# EAGLE design schematic (EAGLE 9.6.2)
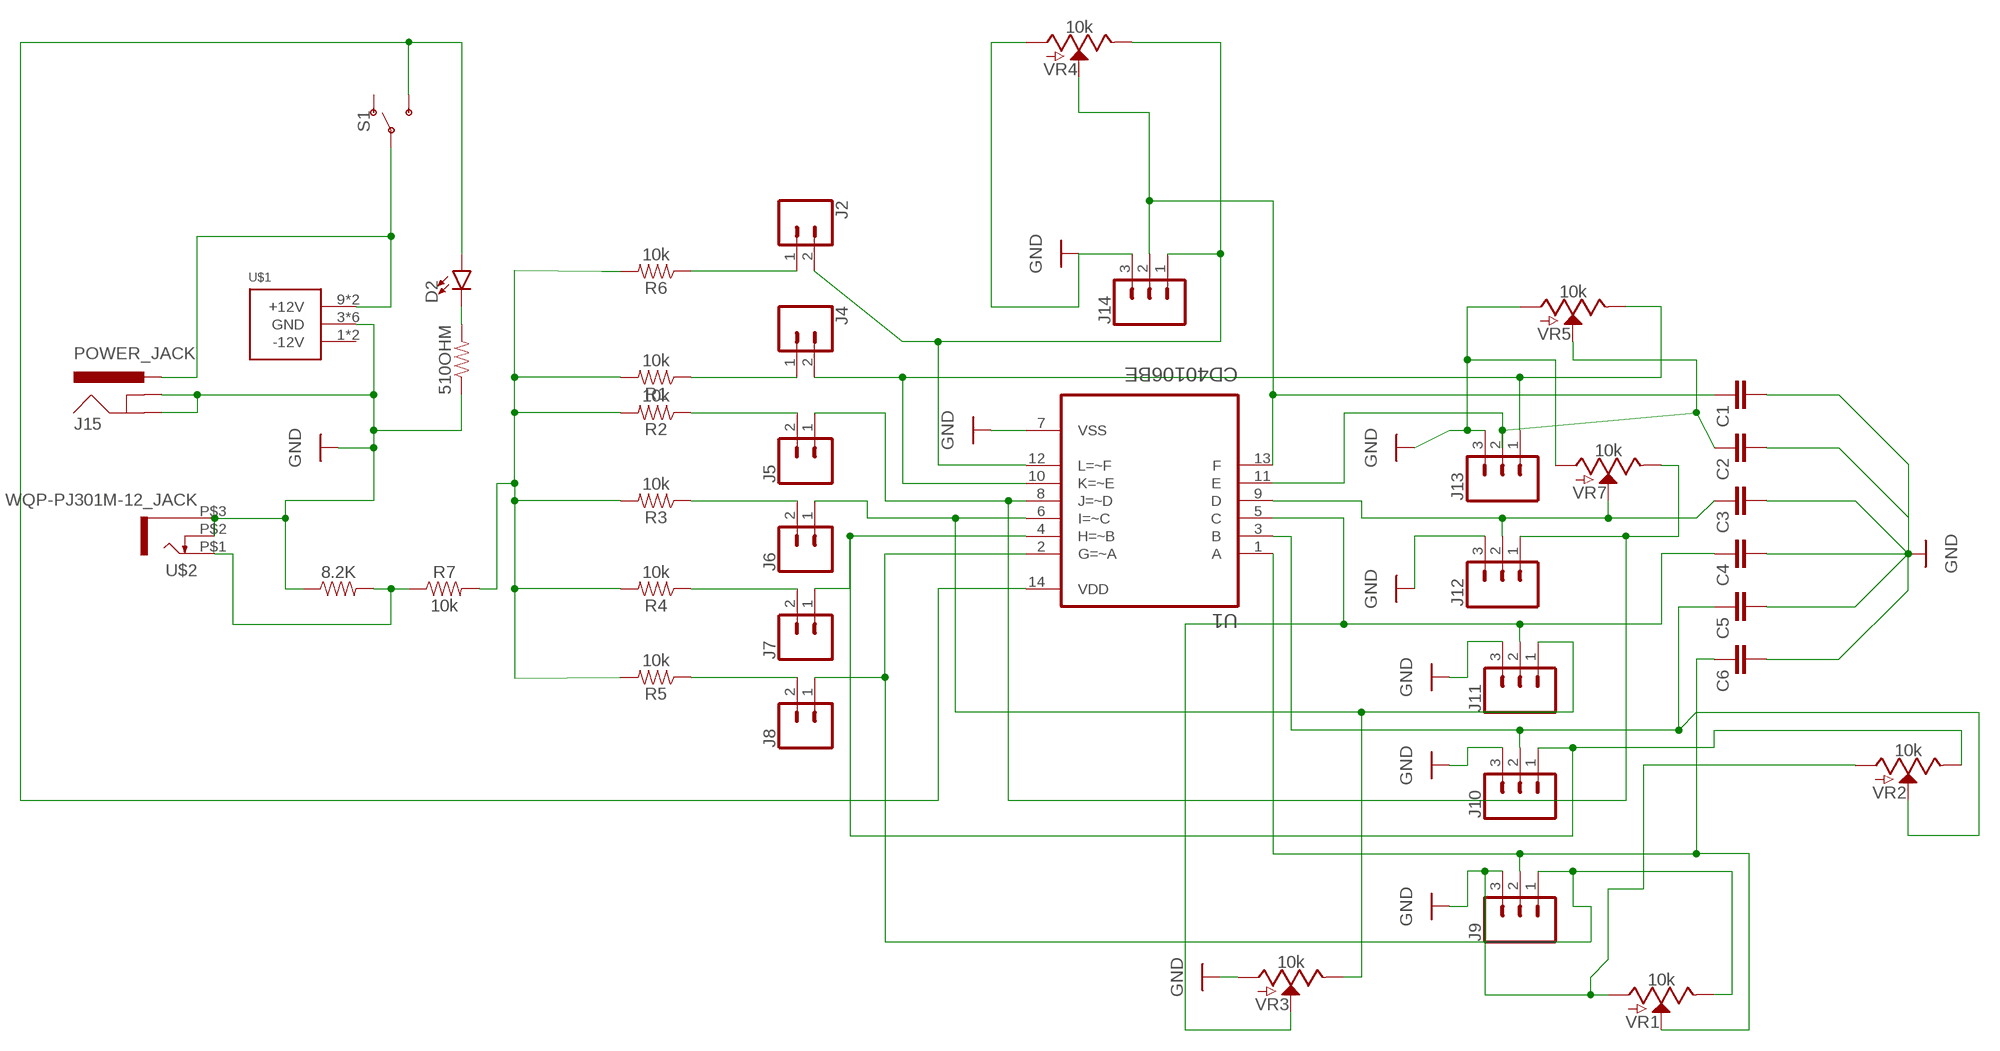
[diagram p0: schematic, sheet 1]

## Parts
8.2K  RESISTORAXIAL-0.3  [AXIAL-0.3]
510OHM  RESISTORAXIAL-0.3  [AXIAL-0.3]
C1  C5/5  [C5B5]
C2  C5/5  [C5B5]
C3  C5/5  [C5B5]
C4  C5/5  [C5B5]
C5  C5/5  [C5B5]
C6  C5/5  [C5B5]
D2  LED5MM  [LED_5MM]
J2  CONN_02  [1X02]
J4  CONN_02  [1X02]
J5  CONN_02  [1X02]
J6  CONN_02  [1X02]
J7  CONN_02  [1X02]
J8  CONN_02  [1X02]
J9  CONN_03  [1X03]
J10  CONN_03  [1X03]
J11  CONN_03  [1X03]
J12  CONN_03  [1X03]
J13  CONN_03  [1X03]
J14  CONN_03  [1X03]
J15  POWER_JACK  [POWER_JACK_PTH]
R1  10k  10KOHM-HORIZ-1/4W-1%  [AXIAL-0.3]
R2  10k  10KOHM-HORIZ-1/4W-1%  [AXIAL-0.3]
R3  10k  10KOHM-HORIZ-1/4W-1%  [AXIAL-0.3]
R4  10k  10KOHM-HORIZ-1/4W-1%  [AXIAL-0.3]
R5  10k  10KOHM-HORIZ-1/4W-1%  [AXIAL-0.3]
R6  10k  10KOHM-HORIZ-1/4W-1%  [AXIAL-0.3]
R7  10k  10KOHM-HORIZ-1/4W-1%  [AXIAL-0.3]
S1  SWITCH-SPDT-PTH-11.6X4.0MM  [SWITCH_SPDT_PTH_11.6X4.0MM]
U1  CD40106BE  [DIP794W45P254L1969H508Q14]
U$1  POWER_SIMPLE16  [POWER_16]
U$2  WQP-PJ301M-12_JACK  [WQP-PJ301M-12_JACK]
VR1  10k  POTENTIOMETER-PTH-9MM-1/20W-20%  [POT-PTH-ALPS]
VR2  10k  POTENTIOMETER-PTH-9MM-1/20W-20%  [POT-PTH-ALPS]
VR3  10k  POTENTIOMETER-PTH-9MM-1/20W-20%  [POT-PTH-ALPS]
VR4  10k  POTENTIOMETER-PTH-9MM-1/20W-20%  [POT-PTH-ALPS]
VR5  10k  POTENTIOMETER-PTH-9MM-1/20W-20%  [POT-PTH-ALPS]
VR7  10k  POTENTIOMETER-PTH-9MM-1/20W-20%  [POT-PTH-ALPS]

## Nets
GND: 8.2K.P$1 510OHM.P$1 C1.2 C2.2 C3.2 C4.2 C5.2 C6.2 J9.3 J10.3 J11.3 J12.3 J13.3 J14.3 J15.GND J15.GNDBREAK U1.7(VSS) U$1.3(GND) U$1.4(GND) U$1.5(GND) U$1.6(GND) U$1.7(GND) U$1.8(GND) U$2.P$2 U$2.P$3 VR1.P$3(A) VR2.P$3(A) VR3.P$3(A) VR4.P$3(A) VR5.P$3(A) VR7.P$3(A)
N$1: 510OHM.P$2 D2.K(C)
N$2: C1.1 J14.2 U1.13(F) VR4.P$2(S)
N$3: J2.2 J14.1 U1.12(L=~F) VR4.P$1(E)
N$4: J4.1 R1.P$1
N$5: J5.1 J12.1 U1.8(J=~D) VR7.P$1(E)
N$6: C4.1 J11.2 U1.5(C) VR3.P$2(S)
N$7: C5.1 J10.2 U1.3(B) VR2.P$2(S)
N$8: C6.1 J9.2 U1.1(A) VR1.P$2(S)
N$9: C2.1 J13.2 U1.11(E) VR5.P$2(S)
N$10: J5.2 R2.P$1
N$11: J8.2 R5.P$1
N$12: J7.2 R4.P$1
N$13: J6.2 R3.P$1
N$14: J2.1 R6.P$1
N$15: J4.2 J13.1 U1.10(K=~E) VR5.P$1(E)
N$16: C3.1 J12.2 U1.9(D) VR7.P$2(S)
N$17: J6.1 J11.1 U1.6(I=~C) VR3.P$1(E)
N$18: J7.1 J10.1 U1.4(H=~B) VR2.P$1(E)
N$19: J8.1 J9.1 U1.2(G=~A) VR1.P$1(E)
N$21: 8.2K.P$2 R7.P$1 U$2.P$1
N$23: R1.P$2 R2.P$2 R3.P$2 R4.P$2 R5.P$2 R6.P$2 R7.P$2
N$24: J15.PWR S1.2(P) U$1.9(+12V) U$1.10(+12V)
N$25: D2.A S1.3(S) U1.14(VDD)
Unconnected: S1.1(O) U$1.1(-12V) U$1.2(-12V)

## Library data of the parts
8.2K 510OHM = SparkFun-Resistors:RESISTOR: Generic Resistor Package
C1-C6 = capacitor-wima:C: CAPACITOR naming: grid - package width
D2 = SparkFun-LED:LED: LED (Generic) Standard schematic elements and footprints for 5mm, 3mm, 1206, and 0603 sized LEDs. Generic LEDs with no color specified.
J2 J4-J8 = SparkFun-Connectors:CONN_02: Multi connection point. Often used as Generic Header-pin footprint for 0.1 inch spaced/style header connections On any of the 0.1 inch spaced packages, you can populate with these: Break Away Headers - Straight <https://www.sparkfun.com/products/116> (PRT-00116) Break Away Male Headers - Right Angle <https://www.sparkfun.com/products/553> (PRT-00553) Female Headers <https://www.sparkfun.com/products/115> (PRT-00115) Break Away Headers - Machine Pin <https://www.sparkfun.com/products/117> (PRT-00117) Break Away Female Headers - Swiss Machine Pin <https://www.sparkfun.com/products/743> (PRT-00743) For SCREWTERMINALS and SPRING TERMINALS visit here: Screw Terimnals on SparkFun.com <https://www.sparkfun.com/search/results?term=Screw+Terminals> (5mm/3.5mm/2.54mm spacing) This device is also useful as a general connection point to wire up your design to another part of your project. Our various solder wires solder well into these plated through hole pads. Hook-Up Wire - Assortment (Stranded, 22 AWG) <https://www.sparkfun.com/products/11375> (PRT-11375) Hook-Up Wire - Assortment (Solid Core, 22 AWG) <https://www.sparkfun.com/products/11367> (PRT-11367) View the entire wire category on our website here <https://www.sparkfun.com/categories/141> Special notes: Molex polarized connector foot print use with: PRT-08233 with associated crimp pins and housings. 2.54_SCREWTERM for use with PRT-10571. 3.5mm Screw Terminal footprints for PRT-08084 5mm Screw Terminal footprints for use with PRT-08432
J9-J14 = SparkFun-Connectors:CONN_03: Multi connection point. Often used as Generic Header-pin footprint for 0.1 inch spaced/style header connections On any of the 0.1 inch spaced packages, you can populate with these: Break Away Headers - Straight <https://www.sparkfun.com/products/116> (PRT-00116) Break Away Male Headers - Right Angle <https://www.sparkfun.com/products/553> (PRT-00553) Female Headers <https://www.sparkfun.com/products/115> (PRT-00115) Break Away Headers - Machine Pin <https://www.sparkfun.com/products/117> (PRT-00117) Break Away Female Headers - Swiss Machine Pin <https://www.sparkfun.com/products/743> (PRT-00743) Stackable Header - 3 Pin (Female, 0.1") <https://www.sparkfun.com/products/13875> (PRT-13875) For SCREWTERMINALS and SPRING TERMINALS visit here: Screw Terimnals on SparkFun.com <https://www.sparkfun.com/search/results?term=Screw+Terminals> (5mm/3.5mm/2.54mm spacing) This device is also useful as a general connection point to wire up your design to another part of your project. Our various solder wires solder well into these plated through hole pads. Hook-Up Wire - Assortment (Stranded, 22 AWG) <https://www.sparkfun.com/products/11375> (PRT-11375) Hook-Up Wire - Assortment (Solid Core, 22 AWG) <https://www.sparkfun.com/products/11367> (PRT-11367) View the entire wire category on our website here <https://www.sparkfun.com/categories/141> Special notes: Molex polarized connector foot print use with SKU : PRT-08232 with associated crimp pins and housings.
J15 = SparkFun-Connectors:POWER_JACK: Power Jack Connector This is the standard 5.5mm barrel jack for power. The PTH is the most common, proven, reliable, footprint. The Slot footprint only works if the mill layer is transmitted to the PCB fab house so be warned. Here are the connectors we sell at SparkFun: DC Barrel Power Jack/Connector <https://www.sparkfun.com/products/119> (PRT-00119) DC Barrel Power Jack/Connector (SMD) <https://www.sparkfun.com/products/12748> (PRT-12748) DC Barrel Jack Adapter - Breadboard Compatible <https://www.sparkfun.com/products/10811> (PRT-10811) It is used on this SparkFun product (and many, many others): SparkFun RedBoard - Programmed with Arduino <https://www.sparkfun.com/products/12757> (DEV-12757) Also, if you need a mating power supply or connector, please check these out: Wall Adapter Power Supply - 9VDC 650mA <https://www.sparkfun.com/products/298> (TOL-00298) DC Barrel Jack Adapter - Male <https://www.sparkfun.com/products/10287> (PRT-10287); PROD_ID: CONN-08197
R1-R7 = SparkFun-Resistors:10KOHM: 10kΩ resistor A resistor is a passive two-terminal electrical component that implements electrical resistance as a circuit element. Resistors act to reduce current flow, and, at the same time, act to lower voltage levels within circuits. - Wikipedia; PROD_ID: RES-12183
S1 = SparkFun-Switches:SWITCH-SPDT: Single Pole, Double Throw (SPDT) Switch Single-pole, double-throw (SPDT) switch. Variant Overview SMD-AYZ0202 Surface Mount DPDT Switch <https://www.sparkfun.com/products/597> (COM-00597) Used on e.g. LilyPad Arduino USB - ATmega32U4 Board <https://www.sparkfun.com/products/12049> PTH-11.6X4.0MM SPDT Mini Power Switch <https://www.sparkfun.com/products/102> (COM-00102) Used on e.g. SparkFun Simon Says - Through-Hole Soldering Kit <https://www.sparkfun.com/products/10547> (KIT-10547) PTH-11.6X4.0MM-KIT KIT version of SPDT Mini Power Switch - Simplifies soldering by removing tStop of switch pins - only one side can be soldered. PTH-11.6X4.0MM-LOCK LOCK version of SPDT Mini Power Switch - Offset pins hold switch in place for easier soldering. SMD-RIGHT-ANGLE Surface Mount Right Angle Switch <https://www.sparkfun.com/products/10860> (COM-10860) Used on e.g. SparkFun ESP8266 Thing <https://www.sparkfun.com/products/13231>; PROD_ID: SWCH-08261; SF_SKU: COM-00102
U1 = CD40106BE:CD40106BE: Check availability <https://pricing.snapeda.com/parts/CD40106BE/Texas%20Instruments/view-part?ref=eda>; AVAILABILITY: In Stock; DESCRIPTION: 6-ch, 3-V to 18-V inverters with Schmitt-Trigger inputs; MF: Texas Instruments; MP: CD40106BE; PACKAGE: PDIP-14 Texas Instruments; PRICE: None; PURCHASE-URL: https://pricing.snapeda.com/search/part/CD40106BE/?ref=eda
U$1 = eurorack:POWER_SIMPLE
U$2 = thonkiconn:WQP-PJ301M-12_JACK
VR1-VR5 VR7 = SparkFun-Resistors:POTENTIOMETER: Potentiometer (Pot) Three-terminal potentiometers, with an adjustable wiper and two adjustable resistors. A pot can be used to create a configurable voltage divider, or as a variable resistor. Variants ALPS_POT and ALPS_POT_KIT - PTH, breadboard compatible, 9mm square pots Rotary Potentiometer - Linear (10k ohm) <https://www.sparkfun.com/products/9288> (COM-09288) The KIT variant exposes copper on only one side of the PTH pad, so the part can only be assembled on one side of the PCB. Useful for beginner soldering kits.; PROD_ID: RES-09177; SF_SKU: COM-09288

## Board
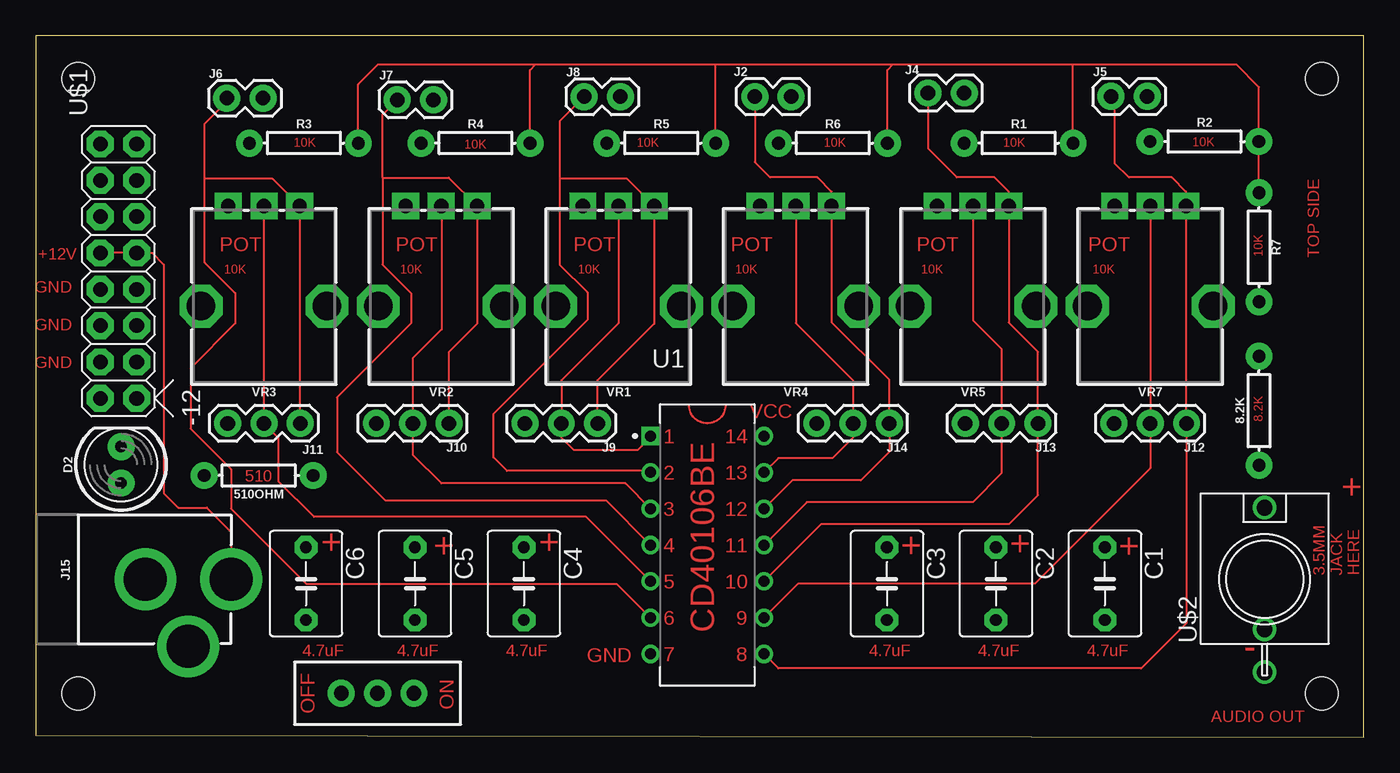
[diagram p1: board, top side]
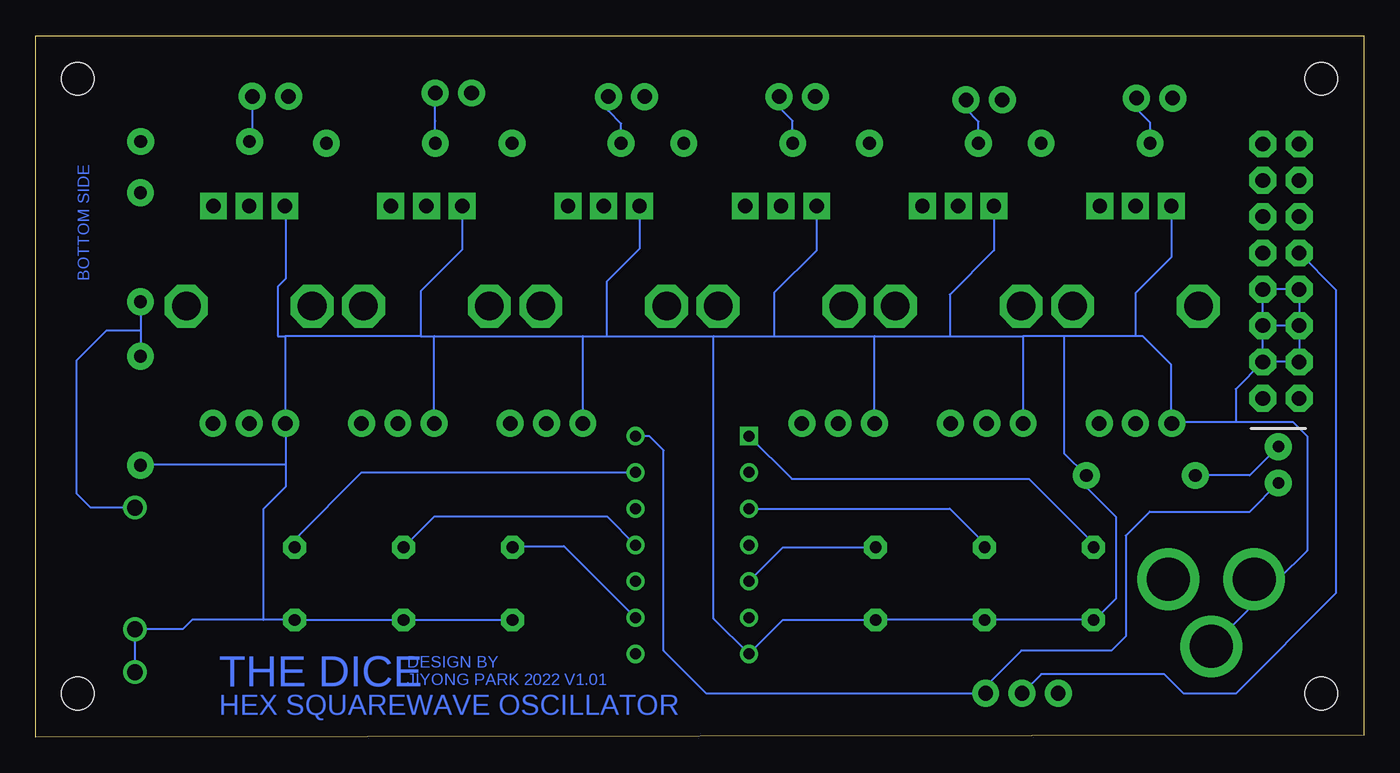
[diagram p2: board, bottom side, seen from below]

Size 92.9 x 49.04 mm. Coordinates in mm from the lower left corner, seen from the top.
Outline: 0,0.13 92.9,0 92.9,49.04 0,49.04 0,0.13
Copper layers (1*16): Top 0.035mm / dielectric 1.5mm / Bottom 0.035mm
Design rules "default": minimum track width 6mil, minimum drill 0.35mm, track to track 6mil, track to pad 6mil, pad to pad 6mil, via to via 6mil, smd to smd 6mil, copper to edge 40mil, drill to drill 6mil, minimum pad ring 10mil, minimum via ring 8mil, stop-mask expansion 4mil, vias tented up to drill 0mil, thermal gap 10mil
Holes 2.3 mm at 2.97,46.04 2.97,3.04 89.97,3.04 89.97,46.04

### Footprints (pad centres in the part's own frame; a part is rotated, then mirrored left to right if it is on the bottom)
AXIAL-0.3 = drill 0.9 pad 1.88: P$1 -3.81,0; P$2 3.81,0
C5B5 = drill 0.813 pad 1.6 octagon: 1 -2.54,0; 2 2.54,0
LED_5MM = drill 0.813 pad 1.88: A -1.27,0; K 1.27,0
1X02 = drill 1.016 pad 1.88: 1 0,0; 2 2.54,0
1X03 = drill 1.016 pad 1.88: 1 0,0; 2 2.54,0; 3 5.08,0
POWER_JACK_PTH = drill 2.997 pad 4.318: GND 0,7.7; GNDBREAK 4.7,10.7; PWR 0,13.7
SWITCH_SPDT_PTH_11.6X4.0MM = drill 1.016 pad 1.88: 1 0,2.54; 2 0,0; 3 0,-2.54
DIP794W45P254L1969H508Q14 = drill 0.77 pad 1.17 square: 1 -3.97,7.62 | drill 0.77 pad 1.17: 2 -3.97,5.08; 3 -3.97,2.54; 4 -3.97,0; 5 -3.97,-2.54; 6 -3.97,-5.08; 7 -3.97,-7.62; 8 3.97,-7.62; 9 3.97,-5.08; 10 3.97,-2.54; 11 3.97,0; 12 3.97,2.54; 13 3.97,5.08; 14 3.97,7.62
POWER_16 = drill 1.016 pad 1.88 octagon: 1 -6.35,-1.27; 2 -6.35,1.27; 3 -3.81,-1.27; 4 -3.81,1.27; 5 -1.27,-1.27; 6 -1.27,1.27; 7 1.27,-1.27; 8 1.27,1.27; 9 3.81,-1.27; 10 3.81,1.27; 11 6.35,-1.27; 12 6.35,1.27; 13 8.89,-1.27; 14 8.89,1.27; 15 11.43,-1.27; 16 11.43,1.27
WQP-PJ301M-12_JACK = drill 1.1: P$1 0,5; P$2 0,-3.5; P$3 0,-6.5
POT-PTH-ALPS = drill 1 pad 1.88 square: P$1 7,-2.5; P$2 7,0; P$3 7,2.5 | drill 2 octagon: P$4 0,-4.4; P$5 0,4.4

### Placement (x,y rotation side)
8.2K  85.57,22.83 90 top
510OHM  15.6,18.29 180 top
C1  74.79,10.73 270 top
C2  67.17,10.73 270 top
C3  59.55,10.73 270 top
C4  34.15,10.73 270 top
C5  26.53,10.73 270 top
C6  18.91,10.73 270 top
D2  5.97,19.04 90 top
J2  52.84,44.79 180 top
J4  64.95,45.04 180 top
J5  75.21,44.8 0 top
J6  13.37,44.67 0 top
J7  25.29,44.56 0 top
J8  38.36,44.78 0 top
J9  39.31,21.94 180 top
J10  28.91,21.94 180 top
J11  18.51,21.94 180 top
J12  80.51,21.94 180 top
J13  70.11,21.94 180 top
J14  59.71,21.94 180 top
J15  -0.03,11.04 270 top
R1  68.76,41.54 0 top
R2  81.76,41.65 0 top
R3  18.76,41.54 0 top
R4  30.76,41.54 0 top
R5  43.76,41.54 0 top
R6  55.76,41.54 0 top
R7  85.57,34.25 90 top
S1  23.91,3.06 90 top
U1  46.97,13.43 0 top
U$1  5.79,30.04 90 top
U$2  85.97,11.04 0 top
VR1  40.77,30.14 90 top
VR2  28.37,30.14 90 top
VR3  15.97,30.14 90 top
VR4  53.17,30.14 90 top
VR5  65.57,30.14 90 top
VR7  77.97,30.14 90 top

### Tracks (layer width: path | path; a pad name or v marks a point on that pad's centre or on a via)
GND
  Top 0.152: U1.7 42.97,5.77
  Bottom 0.152: C3.2 C2.2 C1.2 76.97,8.19 | J10.3 23.83,21.76 | J10.3 23.83,28.04 | J9.3 34.23,28.04 | J14.3 54.63,28.04 | J13.3 65.03,28.04 | U$1.6 U$1.5 | U$1.8 U$1.7 U$1.5 | U$1.6 U$1.4 U$1.3 | U$1.3 U$1.5 | U$1.8 4.51,31.3 | 65.97,28.04 65.03,28.04 | 65.03,28.04 54.63,28.04 | 54.63,28.04 52.97,28.04 | 52.97,28.04 45.48,28.04 | 45.48,28.04 41.23,28.04 | 41.23,28.04 34.23,28.04 | 34.23,28.04 28.97,28.04 | 28.97,28.04 23.83,28.04 | 76.97,8.19 76.95,8.21 76.95,15.97 75.43,17.5 75.43,19.04 | VR1.P$3 38.27,34.06 41.23,31.1 41.23,28.04 | J10.3 23.87,21.98 | VR2.P$3 25.87,34.04 28.97,30.94 28.97,28.04 | VR4.P$3 50.67,34.14 52.97,31.84 52.97,28.04 | VR5.P$3 63.07,34.08 65.97,31.18 65.97,28.04 | 15.97,28.04 20.97,28.04 | 20.97,28.04 23.83,28.04 | 8.2K.P$1 85.48,19.02 85.46,19.04 75.43,19.04 | J11.3 13.47,21.98 13.47,22.04 | 13.47,22.04 13.47,26.04 15.47,28.04 15.97,28.04 | VR3.P$3 13.47,33.54 15.97,31.04 15.97,28.04 | 75.43,19.04 J12.3 75.43,28.04 | 65.97,28.04 75.43,28.04 | 75.43,28.04 75.97,28.04 75.97,31.5 75.43,32.04 75.43,37.04 75.47,37.08 VR7.P$3 | 45.48,28.04 45.48,8.29 U1.7 40.62,8.19 C4.2 C5.2 C6.2 | 13.47,22.04 8.97,22.04 | U$1.8 U$1.6 | 76.97,8.19 81.97,8.19 82.62,7.54 U$2.P$2 U$2.P$3 | U$1.3 8.97,24.33 8.97,22.04 | 20.97,28.04 20.97,19.85 510OHM.P$1 19.41,17.48 17.35,15.42 17.35,9.66 18.82,8.19 | 8.97,22.04 4.97,22.04 3.97,21.04 3.97,13.04 5.97,11.04 J15.GND 7.67,9.34 J15.GNDBREAK
N$1
  Bottom 0.152: D2.K 7.98,18.29 510OHM.P$2
N$2
  Top 0.152: U1.13 51.94,19.51 55.74,19.51 57.17,20.94 J14.2 57.17,24.94 53.17,28.94 VR4.P$2
  Bottom 0.152: C1.1 74.79,13.81 70.09,18.51 U1.13
N$3
  Top 0.152: U1.12 52.94,17.97 57.71,17.97 57.72,17.96 59.71,19.94 J14.1 59.71,24.97 55.67,29.01 VR4.P$1 55.67,38.14 54.67,39.14 51.37,39.14 50.3,40.21 J2.2
N$4
  Bottom 0.152: R1.P$1 64.95,43.07 64.95,43.08 J4.1
N$5
  Top 0.152: U1.8 51.94,4.81 77.33,4.81 80.51,7.99 J12.1 80.47,21.98 VR7.P$1 80.47,38.14 79.47,39.14 76.47,39.14 75.47,40.14 75.47,44.67 J5.1
N$6
  Top 0.152: U1.5 38.5,15.4 19.47,15.4 16.97,17.91 16.97,20.94 J11.2 VR3.P$2
  Bottom 0.152: U1.5 40.62,13.27 C4.1
N$7
  Top 0.152: U1.3 41.24,17.73 28.38,17.73 26.37,19.75 J10.2 26.37,26.47 28.4,28.51 28.4,37.11 VR2.P$2
  Bottom 0.152: C5.1 26.53,13.54 28.96,15.97 U1.3
N$8
  Top 0.152: U1.1 43,20.96 42.11,20.07 37.64,20.07 36.77,20.94 J9.2 36.77,24.94 40.77,28.94 VR1.P$2 40.57,37.34
  Bottom 0.152: U1.1 40,18.05 23.42,18.05 18.91,13.54 C6.1
N$9
  Top 0.152: U1.11 53.94,16.43 65.55,16.43 67.57,18.45 J13.2 67.57,27.14 65.57,29.14 VR5.P$2
  Bottom 0.152: U1.11 52.94,15.43 65.01,15.43 C2.1
N$10
  Bottom 0.152: J5.2 77.75,41.8 77.95,41.8 R2.P$1
N$11
  Bottom 0.152: R5.P$1 39.95,43.08 40.9,44.03 J8.2
N$12
  Bottom 0.152: R4.P$1 26.95,43.05 27.83,43.93 J7.2
N$13
  Bottom 0.152: R3.P$1 14.95,42.97 15.91,43.93 J6.2
N$14
  Bottom 0.152: R6.P$1 51.95,42.89 52.84,43.79 J2.1
N$15
  Top 0.152: U1.10 54.94,14.89 68.09,14.89 70.11,16.91 J13.1 70.11,26.94 68.07,28.98 VR5.P$1 68.07,38.14 67.07,39.14 64.43,39.14 62.41,41.16 J4.2
N$16
  Top 0.152: U1.9 53.32,10.73 69.9,10.73 77.97,18.8 J12.2 VR7.P$2
  Bottom 0.152: U1.9 55.94,13.35 59.47,13.35 C3.1
N$17
  Top 0.152: 11.83,39.04 11.83,33.18 13.97,31.04 13.97,28.93 10.83,25.79 10.83,21.56 13.66,18.72 13.66,15.98 18.93,10.72 40.64,10.72 U1.6 | 11.83,39.04 11.83,42.9 13.37,44.44 J6.1 | J11.1 18.47,21.98 VR3.P$1 16.56,39.04 11.83,39.04
N$18
  Top 0.152: 24.26,39.12 24.26,33.04 26.26,31.04 26.26,28.93 21.08,23.75 21.08,19.93 24.45,16.56 39.88,16.56 U1.4 | J10.1 28.91,26.94 30.87,28.9 VR2.P$1 28.88,39.12 24.26,39.12 | J7.1 24.26,43.53 24.26,39.12
N$19
  Top 0.152: 36.65,40.37 36.65,39.04 | 36.65,39.04 36.65,33.04 38.59,31.1 38.59,29.17 32.01,22.59 32.01,19.57 32.95,18.62 42.89,18.62 U1.2 | 36.65,40.37 36.67,40.39 | J9.1 39.31,24.94 43.27,28.9 VR1.P$1 41.36,39.04 36.65,39.04 | J8.1 36.65,43.07 36.65,40.37
N$21
  Bottom 0.152: R7.P$1 85.57,28.42 | 85.57,28.42 8.2K.P$2 | 85.57,28.42 87.97,28.42 90.06,26.33 90.06,17.04 89.06,16.04 U$2.P$1
N$22
  Top 0.152: 48.24,23.21 arc-180 45.7,23.21
N$23
  Top 0.152: R3.P$2 22.57,45.64 23.97,47.04 34.97,47.04 | 34.97,47.04 47.57,47.04 | 47.57,47.04 59.97,47.04 | 59.97,47.04 72.57,47.04 | R1.P$2 72.57,47.04 | R6.P$2 59.57,46.64 59.97,47.04 | R5.P$2 47.57,47.04 | R4.P$2 34.57,46.64 34.97,47.04 | 72.57,47.04 83.97,47.04 85.57,45.44 R2.P$2 | R2.P$2 R7.P$2 R2.P$2
N$24
  Top 0.152: U$1.10 U$1.9 8.16,33.85 8.97,33.04 8.97,17.04 9.97,16.04 11.97,16.04 13.67,14.34 J15.PWR
  Bottom 0.152: U$1.10 1.97,31.29 1.97,10.04 8.97,3.04 12.6,3.04 13.97,4.41 22.57,4.41 S1.2
N$25
  Bottom 0.152: U1.14 49.98,21.05 48.97,20.04 48.97,6.04 45.97,3.04 26.47,3.04 S1.3 26.45,3.56 23.97,6.04 17.64,6.04 16.64,7.04 16.64,14.09 14.97,15.77 7.97,15.77 D2.A

### Text on the board
Top: 10K | 10K | 10K | 10K | 10K | 10K | TOP SIDE | POT | POT | POT | POT | POT | POT | 10K | +12V | GND | 10K | 10K | 10K | 10K | 10K | 10K | GND | GND | VCC | 8.2K | 1 | 14 | 510 | 2 | 13 | + | 3 | 12 | + | + | 4 | 11 | + | + | + | + | 5 | 10 | 3.5MM / JACK / HERE | 6 | 9 | CD40106BE | 4.7uF | 4.7uF | 4.7uF | GND | 7 | 8 | 4.7uF | 4.7uF | 4.7uF | - | OFF | ON | AUDIO OUT
Bottom: BOTTOM SIDE | DESIGN BY / JIYONG PARK 2022 V1.01 | THE DICE | HEX SQUAREWAVE OSCILLATOR